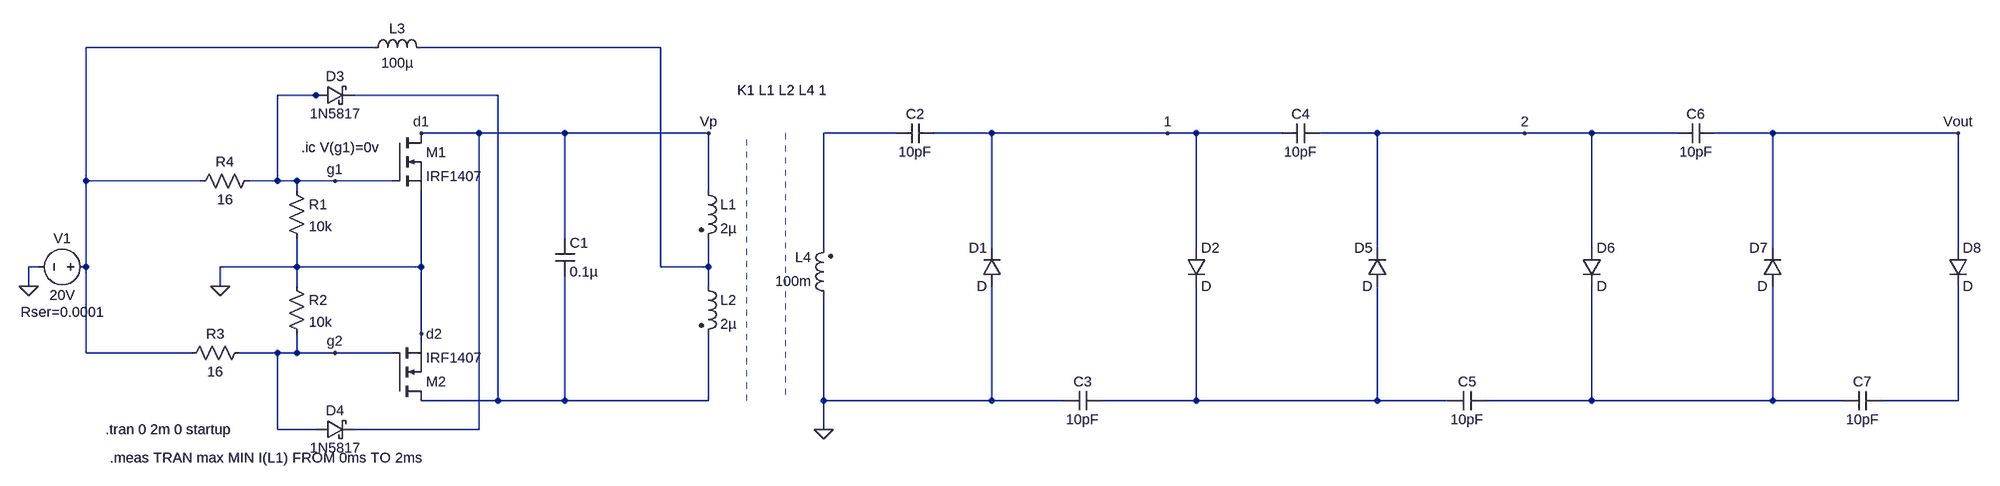
[diagram p0: schematic ZVS driver.asc]
ZVS driver.asc, the LTspice schematic file:
Version 4
SHEET 1 3244 680
WIRE 144 -96 -336 -96
WIRE 624 -96 224 -96
WIRE 48 -16 -16 -16
WIRE 64 -16 48 -16
WIRE 352 -16 112 -16
WIRE 320 48 224 48
WIRE 464 48 320 48
WIRE 704 48 464 48
WIRE 1184 48 896 48
WIRE 1344 48 1248 48
WIRE 1696 48 1344 48
WIRE 1744 48 1696 48
WIRE 1888 48 1744 48
WIRE 2048 48 1952 48
WIRE 2336 48 2048 48
WIRE 2448 48 2336 48
WIRE 2640 48 2448 48
WIRE 2800 48 2704 48
WIRE 3200 48 2800 48
WIRE -336 128 -336 -96
WIRE -144 128 -336 128
WIRE -16 128 -16 -16
WIRE -16 128 -64 128
WIRE 16 128 -16 128
WIRE 80 128 16 128
WIRE 176 128 80 128
WIRE 16 144 16 128
WIRE 704 144 704 48
WIRE 464 224 464 48
WIRE 896 240 896 48
WIRE 1344 240 1344 48
WIRE 1744 240 1744 48
WIRE 2048 240 2048 48
WIRE 2448 240 2448 48
WIRE 2800 240 2800 48
WIRE 3200 240 3200 48
WIRE -416 272 -432 272
WIRE -336 272 -336 128
WIRE 16 272 16 224
WIRE 16 272 -112 272
WIRE 224 272 224 144
WIRE 224 272 16 272
WIRE 624 272 624 -96
WIRE 704 272 704 224
WIRE 704 272 624 272
WIRE -432 304 -432 272
WIRE -112 304 -112 272
WIRE 16 304 16 272
WIRE 704 304 704 272
WIRE 224 384 224 272
WIRE 224 400 224 384
WIRE -336 416 -336 272
WIRE -160 416 -336 416
WIRE -16 416 -80 416
WIRE 16 416 16 384
WIRE 16 416 -16 416
WIRE 80 416 16 416
WIRE 176 416 80 416
WIRE 352 496 352 -16
WIRE 352 496 224 496
WIRE 464 496 464 288
WIRE 464 496 352 496
WIRE 704 496 704 384
WIRE 704 496 464 496
WIRE 896 496 896 320
WIRE 1344 496 1344 304
WIRE 1344 496 896 496
WIRE 1504 496 1344 496
WIRE 1744 496 1744 304
WIRE 1744 496 1568 496
WIRE 2048 496 2048 304
WIRE 2048 496 1744 496
WIRE 2208 496 2048 496
WIRE 2448 496 2448 304
WIRE 2448 496 2272 496
WIRE 2800 496 2800 304
WIRE 2800 496 2448 496
WIRE 2960 496 2800 496
WIRE 3200 496 3200 304
WIRE 3200 496 3024 496
WIRE -16 544 -16 416
WIRE 48 544 -16 544
WIRE 320 544 320 48
WIRE 320 544 112 544
WIRE 896 544 896 496
FLAG -112 304 0
FLAG -432 304 0
FLAG 80 128 g1
FLAG 896 544 0
FLAG 704 48 Vp
FLAG 80 416 g2
FLAG 224 48 d1
FLAG 224 384 d2
FLAG 3200 48 Vout
FLAG 2336 48 2
FLAG 1696 48 1
SYMBOL nmos 176 48 R0
SYMATTR InstName M1
SYMATTR Value IRF1407
SYMBOL nmos 176 496 M180
SYMATTR InstName M2
SYMATTR Value IRF1407
SYMBOL res 0 128 R0
SYMATTR InstName R1
SYMATTR Value 10k
SYMBOL res 0 288 R0
SYMATTR InstName R2
SYMATTR Value 10k
SYMBOL res -64 400 R90
WINDOW 0 0 56 VBottom 2
WINDOW 3 32 56 VTop 2
SYMATTR InstName R3
SYMATTR Value 16
SYMBOL res -48 112 R90
WINDOW 0 0 56 VBottom 2
WINDOW 3 32 56 VTop 2
SYMATTR InstName R4
SYMATTR Value 16
SYMBOL voltage -320 272 R90
WINDOW 0 -32 56 VBottom 2
WINDOW 3 32 56 VTop 2
WINDOW 123 0 0 Left 0
WINDOW 39 60 56 VTop 2
SYMATTR InstName V1
SYMATTR Value 20V
SYMATTR SpiceLine Rser=0.0001
SYMBOL cap 448 224 R0
SYMATTR InstName C1
SYMATTR Value 0.1µ
SYMBOL schottky 48 0 R270
WINDOW 0 32 32 VTop 2
WINDOW 3 0 32 VBottom 2
SYMATTR InstName D3
SYMATTR Value 1N5817
SYMATTR Description Diode
SYMATTR Type diode
SYMBOL schottky 48 560 R270
WINDOW 0 32 32 VTop 2
WINDOW 3 0 32 VBottom 2
SYMATTR InstName D4
SYMATTR Value 1N5817
SYMATTR Description Diode
SYMATTR Type diode
SYMBOL ind2 688 128 R0
SYMATTR InstName L1
SYMATTR Value 2µ
SYMATTR Type ind
SYMBOL ind2 688 288 R0
SYMATTR InstName L2
SYMATTR Value 2µ
SYMATTR Type ind
SYMBOL ind 128 -80 R270
WINDOW 0 32 56 VTop 2
WINDOW 3 5 56 VBottom 2
SYMATTR InstName L3
SYMATTR Value 100µ
SYMBOL ind2 912 336 R180
WINDOW 0 36 80 Left 2
WINDOW 3 36 40 Left 2
SYMATTR InstName L4
SYMATTR Value 100m
SYMATTR Type ind
SYMBOL cap 1248 32 R90
WINDOW 0 0 32 VBottom 2
WINDOW 3 32 32 VTop 2
SYMATTR InstName C2
SYMATTR Value 10pF
SYMATTR SpiceLine V=20kV
SYMBOL diode 1360 304 R180
WINDOW 0 24 64 Left 2
WINDOW 3 24 0 Left 2
SYMATTR InstName D1
SYMBOL cap 1568 480 R90
WINDOW 0 0 32 VBottom 2
WINDOW 3 32 32 VTop 2
SYMATTR InstName C3
SYMATTR Value 10pF
SYMATTR SpiceLine V=20kV
SYMBOL diode 1728 240 R0
SYMATTR InstName D2
SYMBOL cap 1952 32 R90
WINDOW 0 0 32 VBottom 2
WINDOW 3 32 32 VTop 2
SYMATTR InstName C4
SYMATTR Value 10pF
SYMATTR SpiceLine V=20kV
SYMBOL diode 2064 304 R180
WINDOW 0 24 64 Left 2
WINDOW 3 24 0 Left 2
SYMATTR InstName D5
SYMBOL cap 2272 480 R90
WINDOW 0 0 32 VBottom 2
WINDOW 3 32 32 VTop 2
SYMATTR InstName C5
SYMATTR Value 10pF
SYMATTR SpiceLine V=20kV
SYMBOL diode 2432 240 R0
SYMATTR InstName D6
SYMBOL cap 2704 32 R90
WINDOW 0 0 32 VBottom 2
WINDOW 3 32 32 VTop 2
SYMATTR InstName C6
SYMATTR Value 10pF
SYMATTR SpiceLine V=20kV
SYMBOL diode 2816 304 R180
WINDOW 0 24 64 Left 2
WINDOW 3 24 0 Left 2
SYMATTR InstName D7
SYMBOL cap 3024 480 R90
WINDOW 0 0 32 VBottom 2
WINDOW 3 32 32 VTop 2
SYMATTR InstName C7
SYMATTR Value 10pF
SYMATTR SpiceLine V=20kV
SYMBOL diode 3184 240 R0
SYMATTR InstName D8
TEXT 24 72 Left 2 !.ic V(g1)=0v
TEXT -304 544 Left 2 !.tran 0 2m 0 startup
TEXT 752 -24 Left 2 !K1 L1 L2 L4 1
TEXT -296 592 Left 2 !.meas TRAN max MIN I(L1) FROM 0ms TO 2ms
LINE Normal 768 496 768 48 2
LINE Normal 832 48 832 496 2

The netlist it stands for:
* ZVS driver.asc
M1 d1 g1 0 0 IRF1407
M2 N003 g2 0 0 IRF1407
R1 g1 0 10k
R2 0 g2 10k
R3 g2 N001 16
R4 g1 N001 16
V1 N001 0 20V Rser=0.0001
C1 d1 N003 0.1µ
D3 g1 N003 1N5817
D4 g2 d1 1N5817
L1 d1 N002 2µ
L2 N002 N003 2µ
L3 N001 N002 100µ
L4 0 N004 100m
C2 1 N004 10pF V=20kV
D1 0 1 D
C3 N005 0 10pF V=20kV
D2 1 N005 D
C4 2 1 10pF V=20kV
D5 N005 2 D
C5 N006 N005 10pF V=20kV
D6 2 N006 D
C6 Vout 2 10pF V=20kV
D7 N006 Vout D
C7 N007 N006 10pF V=20kV
D8 Vout N007 D
.model D D
.lib standard.dio
.model NMOS NMOS
.model PMOS PMOS
.lib standard.mos
.ic V(g1)=0v
.tran 0 2m 0 startup
K1 L1 L2 L4 1
.meas TRAN max MIN I(L1) FROM 0ms TO 2ms
.backanno
.end